# Altium schematic sheet Led_Chaser.SchDoc
size A4; SheetNumber: 1; SheetTotal: 1
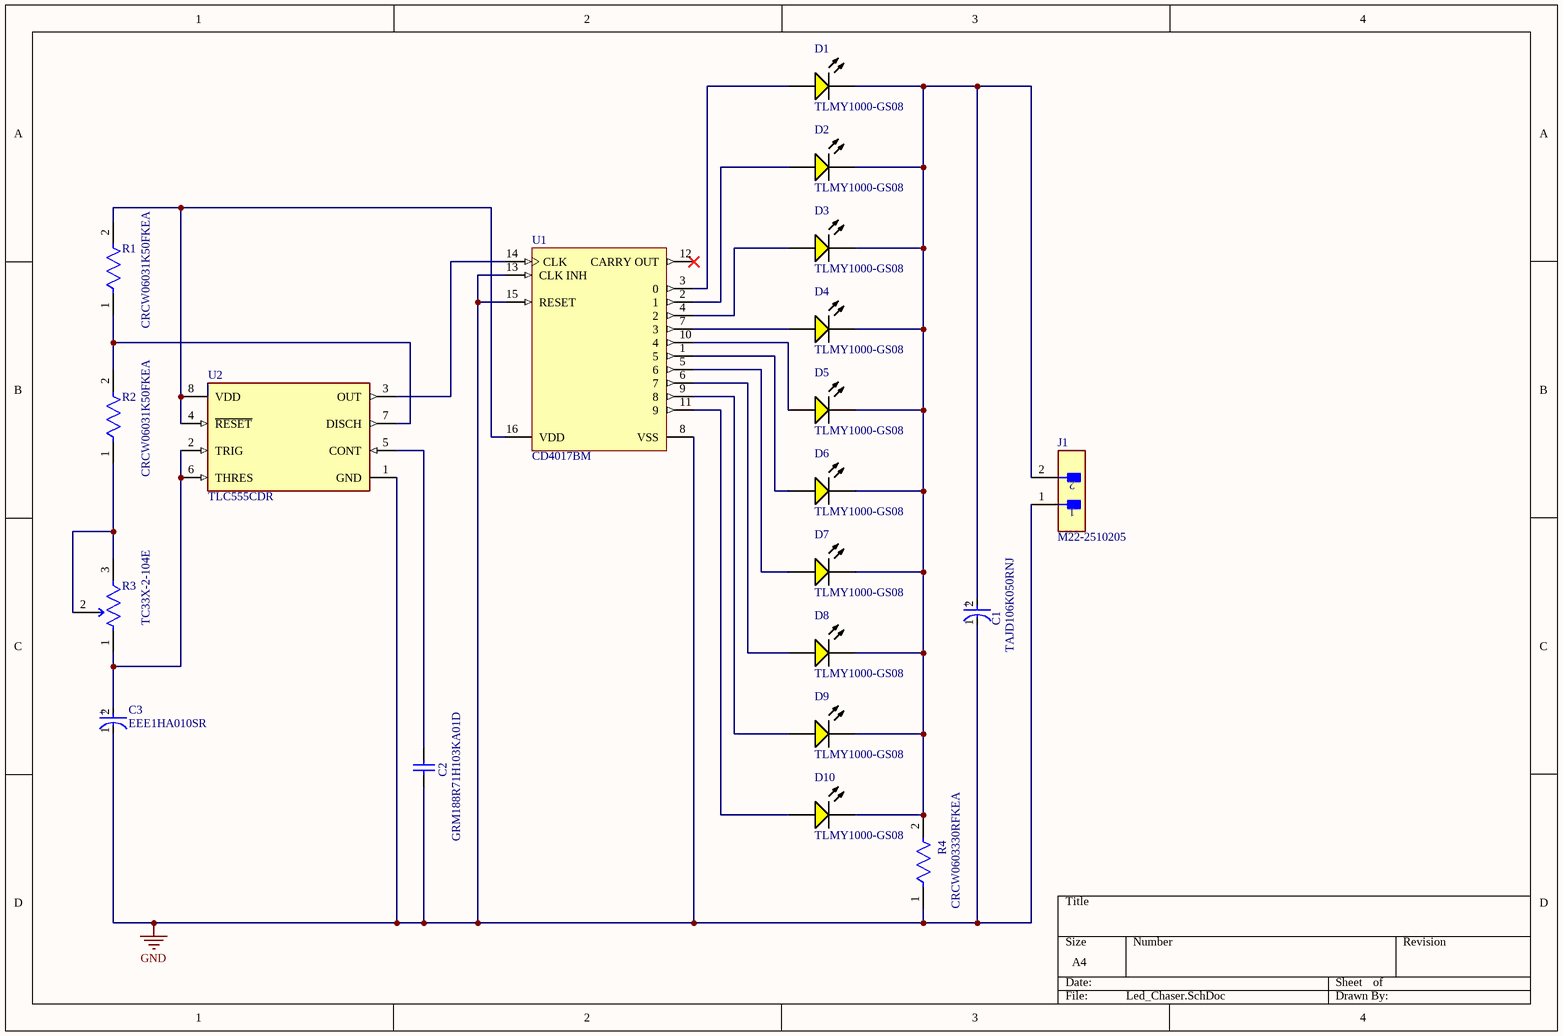
[diagram p0: Led_Chaser.SchDoc]

## Parts
C1  TAJD106K050RNJ  [FP-TAJD-MFG]
C2  GRM188R71H103KA01D  [CAPC1608X90X35ML10T15]
C3  EEE1HA010SR  [FP-SB-MFG]
D1  TLMY1000-GS08  [VISH-TLMY1000_V]
D2  TLMY1000-GS08  [VISH-TLMY1000_V]
D3  TLMY1000-GS08  [VISH-TLMY1000_V]
D4  TLMY1000-GS08  [VISH-TLMY1000_V]
D5  TLMY1000-GS08  [VISH-TLMY1000_V]
D6  TLMY1000-GS08  [VISH-TLMY1000_V]
D7  TLMY1000-GS08  [VISH-TLMY1000_V]
D8  TLMY1000-GS08  [VISH-TLMY1000_V]
D9  TLMY1000-GS08  [VISH-TLMY1000_V]
D10  TLMY1000-GS08  [VISH-TLMY1000_V]
J1  M22-2510205  [FP-M22-2510205-MFG]
R1  CRCW06031K50FKEA  [FP-CRCW0603-e3-IPC_A]
R2  CRCW06031K50FKEA  [FP-CRCW0603-e3-IPC_A]
R3  TC33X-2-104E  [FP-TC33X-2-MFG]
R4  CRCW0603330RFKEA  [FP-CRCW0603-e3-MFG]
U1  CD4017BM  [D0016A_N]
U2  TLC555CDR  [FP-D0008A-IPC_B]

## Nets
GND: C1.1(C) C2.1 C3.1(C) J1.1 R4.1 U1.8(VSS) U1.13(CLK_INH) U1.15(RESET) U2.1(GND)
NetC1_2: C1.2(A) D1.2(K) D2.2(K) D3.2(K) D4.2(K) D5.2(K) D6.2(K) D7.2(K) D8.2(K) D9.2(K) D10.2(K) J1.2 R4.2
NetC2_2: C2.2 U2.5(CONT)
NetC3_2: C3.2(A) R3.1(CCW) U2.2(TRIG) U2.6(THRES)
NetD1_1: D1.1(A) U1.3(0)
NetD2_1: D2.1(A) U1.2(1)
NetD3_1: D3.1(A) U1.4(2)
NetD4_1: D4.1(A) U1.7(3)
NetD5_1: D5.1(A) U1.10(4)
NetD6_1: D6.1(A) U1.1(5)
NetD7_1: D7.1(A) U1.5(6)
NetD8_1: D8.1(A) U1.6(7)
NetD9_1: D9.1(A) U1.9(8)
NetD10_1: D10.1(A) U1.11(9)
NetR1_1: R1.1 R2.2 U2.7(DISCH)
NetR1_2: R1.2 U1.16(VDD) U2.4(~{RESET}) U2.8(VDD)
NetR2_1: R2.1 R3.2(WIPER) R3.3(CW)
NetU1_14: U1.14(CLK) U2.3(OUT)

Not connected (* = marked no-connect by the designer): U1 12(CARRY_OUT)*

## Notes on the sheet
- (in symbol CMP-2000-05063-2) +
- (in symbol CMP-05427-000070-1) +

## Library data of the parts
C1 = CMP-2000-05063-2: 10uF 50V  ±10% 800mΩ 2917  SMD Tantalum Capacitor; Dissipation Factor: 6%; ESR (Equivalent Series Resistance): 800mR; Polarity: Polar; Leakage Current: 5uA; Voltage: 50V; Construction: Flat; REACH SVHC: No SVHC; Case Code (Metric): 7343; Capacitance: 10uF; Package Quantity: 1; Width: 0.169inch; Length: 7.3mm; Radiation Hardening: No; Dielectric Material: Tantalum; Lead Free: Lead Free; Features: General Purpose; Height - Seated (Max): 0.122inch; Voltage Rating: 50V; Series: TAJ; Number of Pins: 2; Max Operating Temperature: 125°C; Min Operating Temperature: -55°C; Case/Package: 2917; Case Code (Imperial): 2917; Packaging: Tape and Reel; RoHS Compliant: Yes; Tolerance: 10%; Termination: SMD/SMT; Depth: 4.3mm; Mount: Surface Mount; Height: 2.9mm; Voltage Rating (DC): 50V
C2 = CMP-2100-03642-1: Chip Capacitor, 10 nF, +/- 10%, 50 V, -55 to 125 degC, 0603 (1608 Metric), RoHS, Tape and Reel; Manufacturer: Murata; Insulation Resistance: 10GR; Dielectric: X7R; Voltage Rating: 50V; Capacitance: 10nF; Material: Ceramic; Package Quantity: 1; Lead Free: LeadFree; Case/Package: 0603; Termination: SMD/SMT; REACH SVHC: Unknown; Manufacturer URL: http://www.murata.com/; Datasheet URL: http://search.murata.co.jp/Ceramy/image/img/A01X/G101/ENG/GRM188R71H103KA01-01.pdf; Mount: SurfaceMount; Datasheet Version: 42401.0; Number of Pins: 2; Length: 1.6mm; Voltage: 50V; Depth: 0.8mm; Tolerance: 10%; Min Operating Temperature: -55degC; Voltage Rating (DC): 50V; Max Operating Temperature: 125degC; Package Description: 2-Pin Surface Mount Device, Body 1.6 x 0.8 mm; RoHSCompliant: True; Case Code (Imperial): 0603; Width: 0.031inch; Case Code (Metric): 1608; Height: 0.8mm; Package Reference: 0603; Packaging: TapeandReel; Thickness: 0.035inch; Dielectric Material: Ceramic
C3 = CMP-05427-000070-1: CAP ALUM 1UF 20% 50V SMD; Polarity: Polar; Dielectric Material: Aluminium; Ripple Current (AC): 10mA; Leakage Current: 3uA; Life (Hours): 2000Hour; Lead Length: 1.8mm; Voltage Rating: 50V; Width: 4.3mm; Capacitance: 1uF; Min Operating Temperature: -40°C; Height: 5.4mm; Height - Seated (Max): 0.213inch; Mount: Surface Mount; RoHS Compliant: Yes; Case/Package: Radial; Packaging: Tape and Reel; Ripple Current: 10mA; Construction: Cylindrical; Contact Plating: Tin; Max Operating Temperature: 85°C; Termination: SMD/SMT; Lead Pitch: 1mm; Package Quantity: 2000; Tolerance: 20%; Number of Pins: 2; Lead Free: Lead Free; Length: 5.5mm; Voltage: 50V; Series: S; Diameter: 4mm; Radiation Hardening: No; Voltage Rating (DC): 50V; REACH SVHC: No SVHC
D1-D10 = CMP-2000-07255-1: Low Current LED, 40 mW, -40 to 100 degC, 2-Pin SMD, RoHS, Tape and Reel; Manufacturer: Vishay; Wavelength Typ: 595nm; Forward Current If: 2mA; Viewing Angle: 80°; Bulb Size: 1.6mmx0.8mm; Forward Voltage: 1.8V; Luminous Intensity: 7.5mcd; SVHC: ToBeAdvised; Automotive Qualification Standard: AEC-Q100; LED Colour: Yellow; Lens Shape: Rectangular; LED Mounting: SMD; Mounting Technology: SurfaceMount; Packaging: CutTape; MSL: MSL2-1year; Datasheet URL: http://www.vishay.com/docs/83172/tlmo1000.pdf; Package Reference: TLMY1000; Manufacturer URL: http://www.vishay.com/; Package Description: 2-Pin Surface Mount Device, Body 1.6 x 0.8 mm; Datasheet Version: Rev. 2.0, 09/2013; Product Range: -
J1 = CMP-15831-000005-1: CONN HEADER VERT 2POS 2MM; Manufacturer: Harwin; Conn Gender: Male; Current Rating: 2A; Number Of Contacts: 2; Conn Orientation: Vertical; Temperature Range Low: -40°C; Device Class L1: Connectors; ComponentLink2URL: https://cdn.harwin.com/pdfs/C018XX_M22_Series_Connectors.pdf; Temperature Range High: +105°C; Pitch: 2mm; Number Of Rows: 1; Temperature: -40°C to +105°C; Automotive: No; Device Class L3: unset; Octopart: https://octopart.com/m22-2510205-harwin-2538221; Mouser Description: Headers & Wire Housings 2 PIN SIL VERTICAL GOLD PIN HEADER; Height: 5.45mm; Category: Conn; Digikey Description: CONN HEADER VERT 2POS 2MM; Contact Material: Gold,Nickel; Lead Free: Yes; ComponentLink2Description: Datasheet; Manufacturer Part Number: M22-2510205; Device Class L2: Headers and Wire Housings; Package: 0; Footprint Url: https://cdn.harwin.com/pdfs/M22-251.pdf; RoHS: TRUE
R1 R2 = CMP-2000-02995-2: RES Thick Film, 1.5kΩ, 1%, 0.1W, 100ppm/°C, 0603; Working Voltage: 75V; Power Rating: 100mW; Resistance: 1.5kR; Max Operating Temperature: 155°C; Features: Automotive AEC-Q200; Min Operating Temperature: -55°C; Width: 0.033inch; Case/Package: 0603; Voltage Rating (DC): 75V; Termination: SMD/SMT; Mount: Surface Mount; Weight: 7.1E-05oz; Case Code (Metric): 1608; Height: 0.45mm; Voltage Rating: 75V; Length: 1.55mm; Package Quantity: 10; Lead Free: Lead Free; Composition: Thick Film; Packaging: Tape and Reel; Temperature Coefficient: 100ppm/°C; Tolerance: 1%; Military Standard: Not; Case Code (Imperial): 0603; Number of Terminations: 2; Max Power Dissipation: 100mW; Depth: 0.85mm; Contact Plating: Tin
R3 = CMP-07234-000040-1: TRIMMER 100K OHM 0.1W J LEAD TOP; Number of Turns: 1; Voltage Rating (DC): 50V; Power Rating: 100mW; Resistance Tolerance: 25%; Resistance: 100kR; Temperature Coefficient: 250ppm/°C; Max Operating Temperature: 100°C; Package Quantity: 2500; REACH SVHC: No SVHC; Termination: Foot Print; Packaging: Tape and Reel; RoHS Compliant: Yes; Military Standard: Not; Color: Silver; Width: 0.118inch; Min Operating Temperature: -40°C; Mount: Surface Mount; Height: 0.047inch; Tolerance: 25%; Resistor Type: Carbon; Length: 3mm; Depth: 3.8mm; Weight: 29.4mg; Max Power Dissipation: 100mW; Series: TC33; Radiation Hardening: No
R4 = CMP-1012-00454-3: RES Thick Film, 330Ω, 1%, 0.1W, 100ppm/°C, 0603; Voltage Rating: 75V; Max Power Dissipation: 100mW; Resistance: 330R; Depth: 0.85mm; Contact Plating: Tin; Package Quantity: 10; Termination: SMD/SMT; Tolerance: 1%; Height: 0.45mm; Number of Terminations: 2; Radiation Hardening: No; Features: Automotive AEC-Q200; Case/Package: 0603; Mount: Surface Mount; Case Code (Metric): 1608; Lead Free: Lead Free; Temperature Coefficient: 100ppm/°C; Weight: 7.1E-05oz; Military Standard: Not; Packaging: Tape and Reel; Max Operating Temperature: 155°C; Voltage Rating (DC): 75V; Length: 1.55mm; Min Operating Temperature: -55°C; Composition: Thick Film; Case Code (Imperial): 0603; Width: 0.033inch; Power Rating: 100mW
U1 = CMP-1623-00071-2: CMOS Decade Counter with 10 Decoded Outputs, D0016A, TUBE; Manufacturer: Texas Instruments; Voltage(Nom)(V): 10; VCC(Min)(V): 3; tpd @ Nom Voltage(Max)(ns): 270; Technology Family: CD4000; VCC(Max)(V): 18; ICC @ Nom Voltage(Max)(mA): 0.03; Schmitt Trigger: No; Inputs: 1; Rating: Military; F @ Nom Voltage(Max)(Mhz): 8; Output Drive (IOL/IOH)(Max)(mA): 1.5/-1.5; Generic Part Number: CD4017B; DatasheetVersion: SCHS027C; Type: Decade; PackageReference: D0016A; Operating Temperature Range(C): -55 to 125; Function: Counter; Bits(#): 10; Code_JEDEC: MS-012 variation AC; Output Type: CMOS; Input Type: CMOS
U2 = CMP-04857-000001-1: IC OSC SGL TIMER 2.1MHZ 8-SOIC; Min Supply Voltage: 2V; Number of Channels: 1; Max Power Dissipation: 725mW; Max Supply Voltage: 15V; Low Level Output Current: 100mA; Current Rating: 250A; Quiescent Current: 250uA; Operating Supply Current: 360uA; High Level Output Current: -10mA; Width: 3.91mm; Case/Package: SOIC; Weight: 0.002561oz; Frequency: 2.1MHz; Height: 1.58mm; Package Quantity: 2500; REACH SVHC: No SVHC; Number of Timers/Counters: 1; Lead Free: Lead Free; Number of Pins: 8; Max Operating Temperature: 125°C; Min Operating Temperature: -40°C; Length: 4.9mm; Radiation Hardening: No; Packaging: Tape and Reel; Termination: SMD/SMT; Mount: Surface Mount; Power Dissipation: 725mW